# Altium schematic sheet Velotour_2022_V1.0.SchDoc: Mailbox Game
size A3; Subtitle: Velotour 2022; Organization: Crelin; Address1: Karl-Neuhaus-Strasse 6, 2502 Biel; Address3: florian.b-h@bluewin.ch; Address4: Tel. (+41) 32-323 56 25 / (+41) 79-502 92 10; DocumentNumber: Velotour 2022; Revision: V1.0; SheetNumber: 1; SheetTotal: 1; CheckedBy: Florian Baumgartner; Author: Florian Baumgartner; DrawnBy: Florian Baumgartner; Engineer: Florian Baumgartner
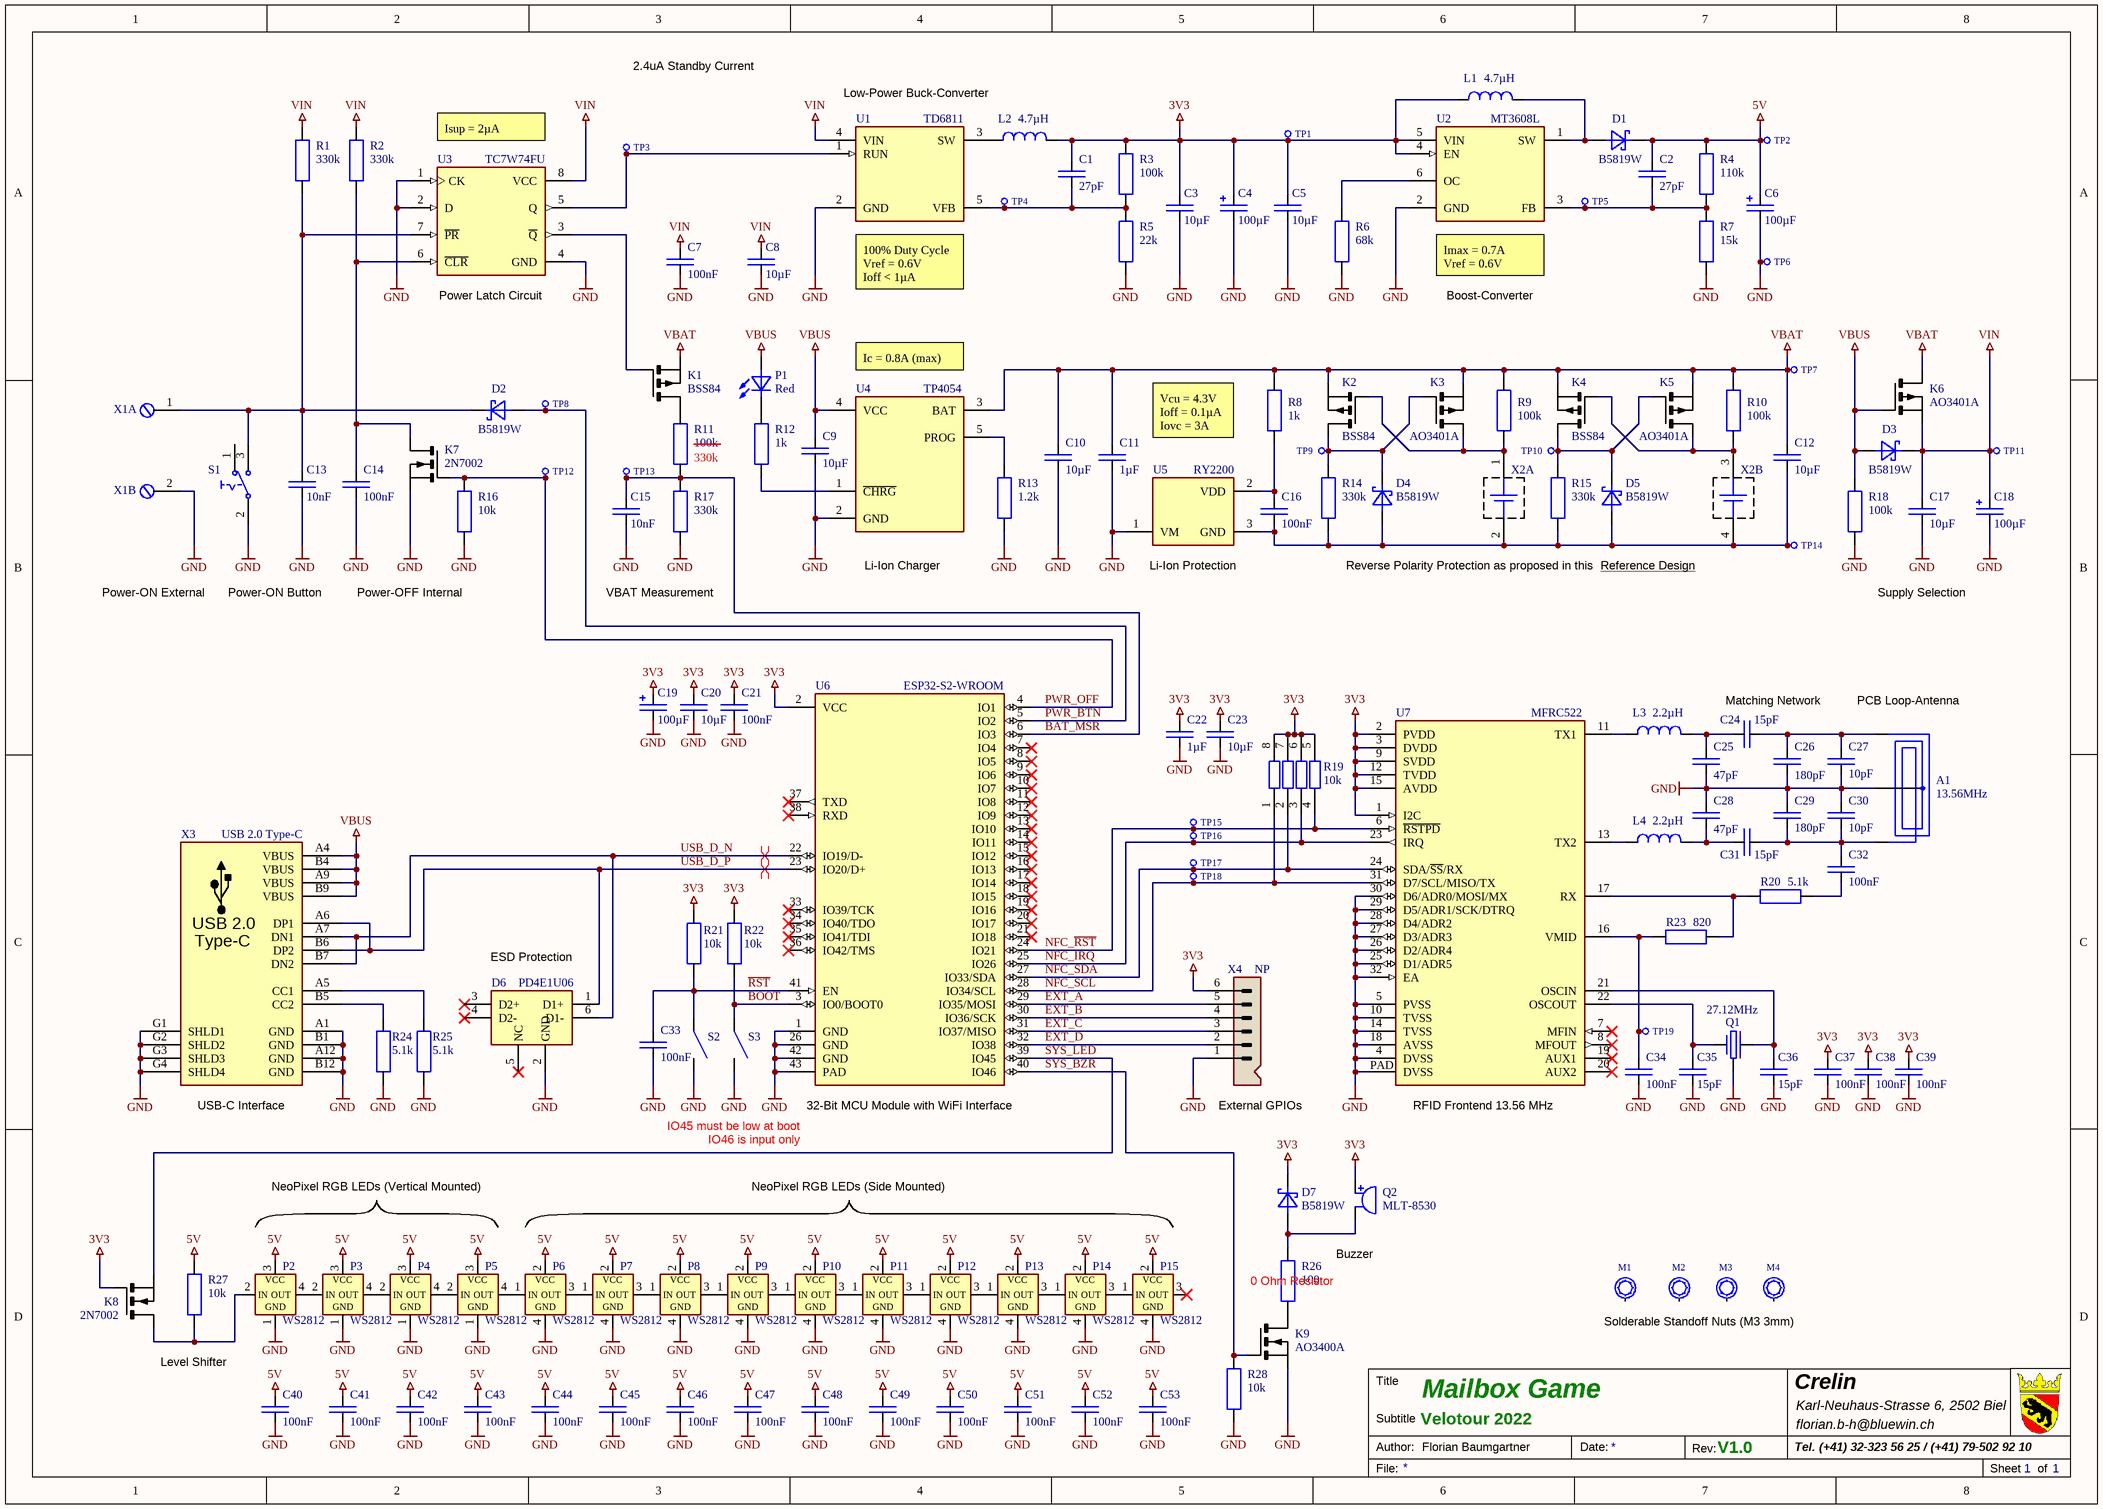
[diagram p0: Velotour_2022_V1.0.SchDoc]

## Parts
A1  13.56MHz  [SMD Loop-Antenna 13.56MHz]
C1  27pF  [SMD Keramikkondensator 0603]
C2  27pF  [SMD Keramikkondensator 0603]
C3  10µF  [SMD Keramikkondensator 1206]
C4  100µF  [SMD Tantalkondensator 1210 +]
C5  10µF  [SMD Keramikkondensator 1206]
C6  100µF  [SMD Tantalkondensator 1210 +]
C7  100nF  [SMD Keramikkondensator 0603]
C8  10µF  [SMD Keramikkondensator 1206]
C9  10µF  [SMD Keramikkondensator 1206]
C10  10µF  [SMD Keramikkondensator 1206]
C11  1µF  [SMD Keramikkondensator 0603]
C12  10µF  [SMD Keramikkondensator 1206]
C13  10nF  [SMD Keramikkondensator 0603]
C14  100nF  [SMD Keramikkondensator 0603]
C15  10nF  [SMD Keramikkondensator 0603]
C16  100nF  [SMD Keramikkondensator 0603]
C17  10µF  [SMD Keramikkondensator 1206]
C18  100µF  [SMD Tantalkondensator 1210 +]
C19  100µF  [SMD Tantalkondensator 1210 +]
C20  10µF  [SMD Keramikkondensator 1206]
C21  100nF  [SMD Keramikkondensator 0603]
C22  1µF  [SMD Keramikkondensator 0603]
C23  10µF  [SMD Keramikkondensator 1206]
C24  15pF  [SMD Keramikkondensator 0603]
C25  47pF  [SMD Keramikkondensator 0603]
C26  180pF  [SMD Keramikkondensator 0603]
C27  10pF  [SMD Keramikkondensator 0603]
C28  47pF  [SMD Keramikkondensator 0603]
C29  180pF  [SMD Keramikkondensator 0603]
C30  10pF  [SMD Keramikkondensator 0603]
C31  15pF  [SMD Keramikkondensator 0603]
C32  100nF  [SMD Keramikkondensator 0603]
C33  100nF  [SMD Keramikkondensator 0603]
C34  100nF  [SMD Keramikkondensator 0603]
C35  15pF  [SMD Keramikkondensator 0603]
C36  15pF  [SMD Keramikkondensator 0603]
C37  100nF  [SMD Keramikkondensator 0603]
C38  100nF  [SMD Keramikkondensator 0603]
C39  100nF  [SMD Keramikkondensator 0603]
C40  100nF  [SMD Keramikkondensator 0603]
C41  100nF  [SMD Keramikkondensator 0603]
C42  100nF  [SMD Keramikkondensator 0603]
C43  100nF  [SMD Keramikkondensator 0603]
C44  100nF  [SMD Keramikkondensator 0603]
C45  100nF  [SMD Keramikkondensator 0603]
C46  100nF  [SMD Keramikkondensator 0603]
C47  100nF  [SMD Keramikkondensator 0603]
C48  100nF  [SMD Keramikkondensator 0603]
C49  100nF  [SMD Keramikkondensator 0603]
C50  100nF  [SMD Keramikkondensator 0603]
C51  100nF  [SMD Keramikkondensator 0603]
C52  100nF  [SMD Keramikkondensator 0603]
C53  100nF  [SMD Keramikkondensator 0603]
D1  B5819W  [SMD Diode SOD-123]
D2  B5819W  [SMD Diode SOD-123]
D3  B5819W  [SMD Diode SOD-123]
D4  B5819W  [SMD Diode SOD-123]
D5  B5819W  [SMD Diode SOD-123]
D6  PD4E1U06  [SMD IC SOT-363 (SC-70-6)]
D7  B5819W  [SMD Diode SOD-123]
K1  BSS84  [SMD MOSFET SOT-23]
K2  BSS84  [SMD MOSFET SOT-23]
K3  AO3401A  [SMD MOSFET SOT-23]
K4  BSS84  [SMD MOSFET SOT-23]
K5  AO3401A  [SMD MOSFET SOT-23]
K6  AO3401A  [SMD MOSFET SOT-23]
K7  2N7002  [SMD MOSFET SOT-23]
K8  2N7002  [SMD MOSFET SOT-23]
K9  AO3400A  [SMD MOSFET SOT-23]
L1  4.7µH  [SMD Inductor 3.2x2.5x1.7]
L2  4.7µH  [SMD Inductor 3.2x2.5x1.7]
L3  2.2µH  [SMD Inductor 0805]
L4  2.2µH  [SMD Inductor 0805]
M1  SMTSO-M3-3ET  [SMD Solder-Nut (M3 3mm)]  (value not drawn)
M2  SMTSO-M3-3ET  [SMD Solder-Nut (M3 3mm)]  (value not drawn)
M3  SMTSO-M3-3ET  [SMD Solder-Nut (M3 3mm)]  (value not drawn)
M4  SMTSO-M3-3ET  [SMD Solder-Nut (M3 3mm)]  (value not drawn)
P1  Red  [SMD LED 0603]
P2  WS2812  [SMD LED WS2812B-3528]
P3  WS2812  [SMD LED WS2812B-3528]
P4  WS2812  [SMD LED WS2812B-3528]
P5  WS2812  [SMD LED WS2812B-3528]
P6  WS2812  [SMD LED WS2812B-4020]
P7  WS2812  [SMD LED WS2812B-4020]
P8  WS2812  [SMD LED WS2812B-4020]
P9  WS2812  [SMD LED WS2812B-4020]
P10  WS2812  [SMD LED WS2812B-4020]
P11  WS2812  [SMD LED WS2812B-4020]
P12  WS2812  [SMD LED WS2812B-4020]
P13  WS2812  [SMD LED WS2812B-4020]
P14  WS2812  [SMD LED WS2812B-4020]
P15  WS2812  [SMD LED WS2812B-4020]
Q1  27.12MHz  [SMD Crystal 3.2X2.5X0.8]
Q2  MLT-8530  [SMD Buzzer (MLT-8530)]
R1  330k  [SMD Widerstand 0603]
R2  330k  [SMD Widerstand 0603]
R3  100k  [SMD Widerstand 0603]
R4  110k  [SMD Widerstand 0603]
R5  22k  [SMD Widerstand 0603]
R6  68k  [SMD Widerstand 0603]
R7  15k  [SMD Widerstand 0603]
R8  1k  [SMD Widerstand 0603]
R9  100k  [SMD Widerstand 0603]
R10  100k  [SMD Widerstand 0603]
R11  100k  [SMD Widerstand 0603]
R12  1k  [SMD Widerstand 0603]
R13  1.2k  [SMD Widerstand 0603]
R14  330k  [SMD Widerstand 0603]
R15  330k  [SMD Widerstand 0603]
R16  10k  [SMD Widerstand 0603]
R17  330k  [SMD Widerstand 0603]
R18  100k  [SMD Widerstand 0603]
R19  10k  [SMD Widerstand Array 4-Fach 0603]
R20  5.1k  [SMD Widerstand 0603]
R21  10k  [SMD Widerstand 0603]
R22  10k  [SMD Widerstand 0603]
R23  820  [SMD Widerstand 0603]
R24  5.1k  [SMD Widerstand 0603]
R25  5.1k  [SMD Widerstand 0603]
R26  100  [SMD Widerstand 0603]
R27  10k  [SMD Widerstand 0603]
R28  10k  [SMD Widerstand 0603]
S1  SS075Q102F035V2A  [THT Micro Switch (SS075Q102F035V2A)]  (value not drawn)
S2  SMD-Button  [SMD Button 5.2x5.2]  (value not drawn)
S3  SMD-Button  [SMD Button 5.2x5.2]  (value not drawn)
TP1  X-TP  [SMD Testpunkt Ø1mm]  (value not drawn)  (no BOM)
TP2  X-TP  [SMD Testpunkt Ø1mm]  (value not drawn)  (no BOM)
TP3  X-TP  [SMD Testpunkt Ø1mm]  (value not drawn)  (no BOM)
TP4  X-TP  [SMD Testpunkt Ø1mm]  (value not drawn)  (no BOM)
TP5  X-TP  [SMD Testpunkt Ø1mm]  (value not drawn)  (no BOM)
TP6  X-TP  [SMD Testpunkt Ø1mm]  (value not drawn)  (no BOM)
TP7  X-TP  [SMD Testpunkt Ø1mm]  (value not drawn)  (no BOM)
TP8  X-TP  [SMD Testpunkt Ø1mm]  (value not drawn)  (no BOM)
TP9  X-TP  [SMD Testpunkt Ø1mm]  (value not drawn)  (no BOM)
TP10  X-TP  [SMD Testpunkt Ø1mm]  (value not drawn)  (no BOM)
TP11  X-TP  [SMD Testpunkt Ø1mm]  (value not drawn)  (no BOM)
TP12  X-TP  [SMD Testpunkt Ø1mm]  (value not drawn)  (no BOM)
TP13  X-TP  [SMD Testpunkt Ø1mm]  (value not drawn)  (no BOM)
TP14  X-TP  [SMD Testpunkt Ø1mm]  (value not drawn)  (no BOM)
TP15  X-TP  [SMD Testpunkt Ø1mm]  (value not drawn)  (no BOM)
TP16  X-TP  [SMD Testpunkt Ø1mm]  (value not drawn)  (no BOM)
TP17  X-TP  [SMD Testpunkt Ø1mm]  (value not drawn)  (no BOM)
TP18  X-TP  [SMD Testpunkt Ø1mm]  (value not drawn)  (no BOM)
TP19  X-TP  [SMD Testpunkt Ø1mm]  (value not drawn)  (no BOM)
U1  TD6811  [SMD IC SOT-23-5]
U2  MT3608L  [SMD IC SOT-23-6]
U3  TC7W74FU  [SMD IC TSSOP-8]
U4  TP4054  [SMD IC SOT-23-5]
U5  RY2200  [SMD IC SOT-23-3]
U6  ESP32-S2-WROOM  [SMD ESP32-S2-WROOM]
U7  MFRC522  [SMD IC QFN-32]
X1  X-Klemme (2-Pol)  [THT Schraubklemme 2-Pol (WJ500V-5.08-2P)]  (value not drawn)  (parts A,B of 2)
X2  18650 Dual Battery Holder  [SMD Battery-Holder (1048P)]  (value not drawn)  (parts A,B of 2)
X3  USB 2.0 Type-C  [THT USB-C Socket (KH-TYPE-C-L10-14P)]
X4  NP  [THT Pin-Header 1x6 (NP)]

## Nets
3V3: C1.1 C3.2 C4.P(+) C5.2 C19.P(+) C20.2 C21.2 C22.2 C23.2 C37.2 C38.2 C39.2 D7.K K8.G L1.1 L2.2 Q2.1(P) R3.2 R19.5 R19.6 R19.7 R19.8 R21.2 R22.2 TP1.1 U2.4(EN) U2.5(VIN) U6.2(VCC) U7.1(I2C) U7.2(PVDD) U7.3(DVDD) U7.9(SVDD) U7.12(TVDD) U7.15(AVDD) X4.6
5V: C2.1 C6.P(+) C40.2 C41.2 C42.2 C43.2 C44.2 C45.2 C46.2 C47.2 C48.2 C49.2 C50.2 C51.2 C52.2 C53.2 D1.K P2.3(VCC) P3.3(VCC) P4.3(VCC) P5.3(VCC) P6.2(VCC) P7.2(VCC) P8.2(VCC) P9.2(VCC) P10.2(VCC) P11.2(VCC) P12.2(VCC) P13.2(VCC) P14.2(VCC) P15.2(VCC) R4.2 R27.2 TP2.1
GND: A1.3(M) C3.1 C4.M(-) C5.1 C6.M(-) C7.1 C8.1 C9.1 C10.1 C11.1 C13.1 C14.1 C15.1 C17.1 C18.M(-) C19.M(-) C20.1 C21.1 C22.1 C23.1 C25.2 C26.2 C27.2 C28.1 C29.1 C30.1 C33.1 C34.1 C35.2 C36.2 C37.1 C38.1 C39.1 C40.1 C41.1 C42.1 C43.1 C44.1 C45.1 C46.1 C47.1 C48.1 C49.1 C50.1 C51.1 C52.1 C53.1 D6.2(GND) K7.S K9.S P2.1(GND) P3.1(GND) P4.1(GND) P5.1(GND) P6.4(GND) P7.4(GND) P8.4(GND) P9.4(GND) P10.4(GND) P11.4(GND) P12.4(GND) P13.4(GND) P14.4(GND) P15.4(GND) Q1.3 R5.1 R6.2 R7.1 R13.1 R16.1 R17.1 R18.1 R24.2 R25.2 R28.1 S1.2(COMMON1) S2.2 S3.2 TP6.1 U1.2(GND) U2.2(GND) U3.1(CK) U3.2(D) U3.4(GND) U4.2(GND) U5.1(VM) U6.1(GND) U6.26(GND) U6.42(GND) U6.43(PAD) U7.4(DVSS) U7.5(PVSS) U7.10(TVSS) U7.14(TVSS) U7.18(AVSS) U7.25(D1/ADR5) U7.26(D2/ADR4) U7.27(D3/ADR3) U7.28(D4/ADR2) U7.29(D5/ADR1/SCK/DTRQ) U7.30(D6/ADR0/MOSI/MX) U7.32(EA) U7.PAD(DVSS) X1.2 X3.A1(GND) X3.A12(GND) X3.B1(GND) X3.B12(GND) X3.G1(SHLD1) X3.G2(SHLD2) X3.G3(SHLD3) X3.G4(SHLD4) X4.1
VBAT: C10.2 C11.2 C12.2 K1.S K2.S K3.S K4.S K5.S K6.D R8.2 R9.2 R10.2 TP7.1 U4.3(BAT)
VBUS: C9.2 D3.A K6.G P1.A R18.2 U4.4(VCC) X3.A4(VBUS) X3.A9(VBUS) X3.B4(VBUS) X3.B9(VBUS)
VIN: C7.2 C8.2 C17.2 C18.P(+) D3.K K6.S R1.2 R2.2 TP11.1 U1.4(VIN) U3.8(VCC)
BAT_MSR: C15.2 R11.1 R17.2 TP13.1 U6.6(IO3)
BOOT: R22.1 S3.1 U6.3(IO0/BOOT0)
EXT_A: U6.29(IO35/MOSI) X4.5
EXT_B: U6.30(IO36/SCK) X4.4
EXT_C: U6.31(IO37/MISO) X4.3
EXT_D: U6.32(IO38) X4.2
NFC_~{IRQ}: R19.3 TP16.1 U6.25(IO26) U7.23(IRQ)
NFC_~{RST}: R19.4 TP15.1 U6.24(IO21) U7.6(~{RSTPD})
NFC_SCL: R19.1 TP18.1 U6.28(IO34/SCL) U7.31(D7/SCL/MISO/TX)
NFC_SDA: R19.2 TP17.1 U6.27(IO33/SDA) U7.24(SDA/~{SS}/RX)
PWR_BTN: D2.A TP8.1 U6.5(IO2)
PWR_OFF: K7.G R16.2 TP12.1 U6.4(IO1)
~{RST}: C33.2 R21.1 S2.1 U6.41(EN)
SYS_BZR: K9.G R28.2 U6.40(IO46)
SYS_LED: K8.S U6.39(IO45)
USB_D_N: D6.6(D1-) U6.22(IO19/D-) X3.A7(DN1) X3.B7(DN2)
USB_D_P: D6.1(D1+) U6.23(IO20/D+) X3.A6(DP1) X3.B6(DP2)
NetA1_1: A1.1(A) C24.2 C26.1 C27.1
NetA1_2: A1.2(B) C29.2 C30.2 C31.2 C32.1
NetC1_2: C1.2 R3.1 R5.2 TP4.1 U1.5(VFB)
NetC2_2: C2.2 R4.1 R7.2 TP5.1 U2.3(FB)
NetC12_1: C12.1 C16.1 D4.A D5.A R14.1 R15.1 TP14.1 U5.3(GND) X2.2(B1N) X2.4(B2N)
NetC13_2: C13.2 D2.K R1.1 S1.3(NO1) U3.7(~{PR}) X1.1
NetC14_2: C14.2 K7.D R2.1 U3.6(~{CLR})
NetC16_2: C16.2 R8.1 U5.2(VDD)
NetC24_1: C24.1 C25.1 L3.2
NetC28_2: C28.2 C31.1 L4.2
NetC32_2: C32.2 R20.2
NetC34_2: C34.2 R23.2 TP19.1 U7.16(VMID)
NetC35_1: C35.1 Q1.1 U7.22(OSCOUT)
NetC36_1: C36.1 Q1.2 U7.21(OSCIN)
NetD1_A: D1.A L1.2 U2.1(SW)
NetD4_K: D4.K K2.D K3.G R14.2 TP9.1
NetD5_K: D5.K K4.D K5.G R15.2 TP10.1
NetD7_A: D7.A Q2.2(M) R26.1
NetK1_D: K1.D R11.2
NetK1_G: K1.G U3.3(~{Q})
NetK2_G: K2.G K3.D R9.1 X2.1(B1P)
NetK4_G: K4.G K5.D R10.1 X2.3(B2P)
NetK8_D: K8.D P2.2(IN) R27.1
NetK9_D: K9.D R26.2
NetL2_1: L2.1 U1.3(SW)
NetL3_1: L3.1 U7.11(TX1)
NetL4_1: L4.1 U7.13(TX2)
NetP1_K: P1.K R12.1
NetP2_4: P2.4(OUT) P3.2(IN)
NetP3_4: P3.4(OUT) P4.2(IN)
NetP4_4: P4.4(OUT) P5.2(IN)
NetP5_4: P5.4(OUT) P6.1(IN)
NetP6_3: P6.3(OUT) P7.1(IN)
NetP7_3: P7.3(OUT) P8.1(IN)
NetP8_3: P8.3(OUT) P9.1(IN)
NetP9_3: P9.3(OUT) P10.1(IN)
NetP10_3: P10.3(OUT) P11.1(IN)
NetP11_3: P11.3(OUT) P12.1(IN)
NetP12_3: P12.3(OUT) P13.1(IN)
NetP13_3: P13.3(OUT) P14.1(IN)
NetP14_3: P14.3(OUT) P15.1(IN)
NetR6_1: R6.1 U2.6(OC)
NetR12_2: R12.2 U4.1(~{CHRG})
NetR13_2: R13.2 U4.5(PROG)
NetR20_1: R20.1 R23.1 U7.17(RX)
NetR24_1: R24.1 X3.B5(CC2)
NetR25_1: R25.1 X3.A5(CC1)
NetTP3_1: TP3.1 U1.1(RUN) U3.5(Q)

Not connected (* = marked no-connect by the designer): D6 3(D2+)* 4(D2-)* 5(NC)*; M1 1; M2 1; M3 1; M4 1; P15 3(OUT)*; S1 1(NC1); U6 7(IO4)* 8(IO5)* 9(IO6)* 10(IO7)* 11(IO8)* 12(IO9)* 13(IO10)* 14(IO11)* 15(IO12)* 16(IO13)* 17(IO14)* 18(IO15)* 19(IO16)* 20(IO17)* 21(IO18)* 33(IO39/TCK)* 34(IO40/TDO)* 35(IO41/TDI)* 36(IO42/TMS)* 37(TXD)* 38(RXD)*; U7 7(MFIN)* 8(MFOUT)* 19(AUX1)* 20(AUX2)*

## Layout directives
differential pair: USB_D_N, USB_D_P

## Notes on the sheet
- 2.4uA Standby Current
- Low-Power Buck-Converter
- (near U3) Isup = 2µA
- (near U3) Power Latch Circuit
- (near U1) 100% Duty Cycle
  Vref = 0.6V
  Ioff < 1µA
- (near U2) Imax = 0.7A
  Vref = 0.6V
- Boost-Converter
- (near U4) Ic = 0.8A (max)
- (near R11) 330k
- Vcu = 4.3V
  Ioff = 0.1µA
  Iovc = 3A
- Power-ON External
- Power-ON Button
- Power-OFF Internal
- VBAT Measurement
- (near U4) Li-Ion Charger
- (near U5) Li-Ion Protection
- Reverse Polarity Protection as proposed in this
- Reference Design <https://www.edn.com/reverse-voltage-protection-for-battery-chargers/>
- Supply Selection
- (near C24) Matching Network
- (near A1) PCB Loop-Antenna
- (near D6) ESD Protection
- (near X3) USB-C Interface
- (near U6) IO45 must be low at boot
- (near U6) 32-Bit MCU Module with WiFi Interface
- (near X4) External GPIOs
- (near U7) RFID Frontend 13.56 MHz
- NeoPixel RGB LEDs (Vertical Mounted)
- IO46 is input only
- NeoPixel RGB LEDs (Side Mounted)
- Buzzer
- 0 Ohm Resistor
- Solderable Standoff Nuts (M3 3mm)
- Level Shifter
- Title
- Crelin
- Author:
- Subtitle
- Date:
- Rev:
- File:
- Sheet
- of
- (in symbol X-USB-Buchse_Vertical) USB 2.0

## Library data of the parts
A1 = A-Loop-Antenna: PCB Loop-Antenna; Component Description: PCB Loop-Antenna; Component Value: 13.56MHz; Unit Price: 0.00
C1 C2 = C-CAPACITOR: CAP-MK; Component Description: Multilayer Ceramic Capacitors; Component Value: 27pF 50V; Digikey: 399-C0603C270J5GAC7867CT-ND; Farnell: 1414627; Mouser: 80-C0603C270J5G; JLC-Parts: C107045; Unit Price: 0.01
C3 C5 C8 = C-CAPACITOR: CAP-MK; Component Description: Multilayer Ceramic Capacitors; Component Value: 10µF 50V; Digikey: 445-7886-1-ND; Farnell: 2211092; Mouser: 810-CGA5L3X5R1H106K; JLC-Parts: C13585; Unit Price: 0.27
C4 C6 C18 C19 = C-ELCAP: CAP-Elko; Component Description: Tantalum Capacitor; Component Value: 100µF 6.3V; Digikey: 478-1677-1-ND; Farnell: 1135048; Mouser: 581-TAJB107K006R; JLC-Parts: C16133; Unit Price: 0.08
C7 C14 C16 C21 C32-C34 C37-C53 = E6 - 100nF: SMD Ceramic Capacitor E6; Component Value: 100nF 50V; Component Description: Multilayer Ceramic Capacitors MLCC; ComponentLink1Description: Datasheet; ComponentLink1URL: https://datasheet.lcsc.com/lcsc/1809301912_YAGEO-CC0603KRX7R9BB104_C14663.pdf; Digikey: 445-6899-1-ND; Farnell: 2210822; JLC-Parts: C14663; Mouser: 810-CGA2B3X7R1H104K; Unit Price: 0.01
C9 C10 C12 C17 C20 C23 = E6 - 10uF: SMD Ceramic Capacitor E6; Component Value: 10µF 50V; Component Description: Multilayer Ceramic Capacitors MLCC; ComponentLink1Description: Datasheet; ComponentLink1URL: https://datasheet.lcsc.com/lcsc/1810191219_Samsung-Electro-Mechanics-CL10A106KP8NNNC_C19702.pdf; Digikey: 587-3258-1-ND; Farnell: 2113070; JLC-Parts: C13585; Mouser: 963-LMK107BBJ106MALT; Unit Price: 0.01
C11 C22 = C-CAPACITOR: CAP-MK; Component Description: Multilayer Ceramic Capacitors; Component Value: 1µF 50V; Digikey: 1276-1860-1-ND; Farnell: 3013383; Mouser: 187-CL10A105KB8NNNC; JLC-Parts: C15849; Unit Price: 0.01
C13 C15 = C-CAPACITOR: CAP-MK; Component Description: Multilayer Ceramic Capacitors; Component Value: 10nF 50V; Digikey: 445-5662-1-ND; Farnell: 2346966; Mouser: 77-VJ0603V103ZXAPBC; JLC-Parts: C57112; Unit Price: 0.01
C24 C31 C35 C36 = C-CAPACITOR: CAP-MK; Component Description: Multilayer Ceramic Capacitors; Component Value: 15pF 50V; Digikey: 399-C0603C150J5GAC7867CT-ND; Farnell: 1414614; Mouser: 80-C0603C150J5G; JLC-Parts: C1644; Unit Price: 0.01
C25 C28 = C-CAPACITOR: CAP-MK; Component Description: Multilayer Ceramic Capacitors; Component Value: 47pF 50V; Digikey: 399-C0603C470J5GAC7867CT-ND; Farnell: 1414639; Mouser: 80-C0603C470J5G; JLC-Parts: C1671; Unit Price: 0.01
C26 C29 = C-CAPACITOR: CAP-MK; Component Description: Multilayer Ceramic Capacitors; Component Value: 180pF 50V; Digikey: 399-C0603C181J5GAC7867CT-ND; Farnell: 1414621; Mouser: 80-C0603C181J5G; JLC-Parts: C85299; Unit Price: 0.01
C27 C30 = C-CAPACITOR: CAP-MK; Component Description: Multilayer Ceramic Capacitors; Component Value: 10pF 50V; Digikey: 399-C0603C100J5GAC7867CT-ND; Farnell: 1414601; Mouser: 80-C0603C100J5G; JLC-Parts: C1634; Unit Price: 0.01
D1-D5 D7 = R-DIODE:SCHKY: S-DIODE; Component Description: Low Voltage Schottky-Diode; Mouser: 833-B5819W-TP; Farnell: 2306459; Digikey: B5819W-TPMSCT-ND; JLC-Parts: C8598; Component Value: B5819W; Unit Price: 0.03
D6 = PD4E1U06DCKR: Unidirectional 3A (8/20us) 15V (Typ) 6.5V 5.5V (Max) SOT-363 ESD Protection Devices ROHS; Component Description: ESD Suppressor; ComponentLink1Description: Datasheet; ComponentLink1URL: https://datasheet.lcsc.com/lcsc/1810172210_Texas-Instruments-TPD4E1U06DCKR_C194628.pdf; Component Value: PD4E1U06; Digikey: 296-39347-1-ND; Farnell: 3116516; JLC-Parts: C194628; Mouser: 595-TPD4E1U06DCKR; Unit Price: 0.12
K1 K2 K4 = K-FET:PIGE: MOSFET P-Channel; Component Value: LBSS84LT1G; Digikey: 1801-BSS84CT-ND; Farnell: 1713836; Mouser: 771-BSS84-T/R; Component Description: MOSFET P-Channel; ComponentLink1Description: Datasheet; ComponentLink1URL: https://datasheet.lcsc.com/lcsc/1811031711_LRC-LBSS84LT1G_C8492.pdf; JLC-Parts: C8492; Unit Price: 0.03
K3 K5 K6 = K-FET:PIGE: MOSFET P-Channel; Digikey: 785-1001-1-ND; Component Description: MOSFET P-Channel; ComponentLink1Description: Datasheet; ComponentLink1URL: https://datasheet.lcsc.com/lcsc/1810171817_Alpha---Omega-Semicon-AO3401A_C15127.pdf; Component Value: AO3401A; JLC-Parts: C15127; Unit Price: 0.14
K7-K9 = K-FET:NIGE: MOSFET N-Channel; ComponentLink1Description: Datasheet; Component Description: MOSFET N-Channel
  K7 K8: Digikey: 2N7002NCT-ND; Farnell: 1713823; Mouser: 512-2N7002; ComponentLink1URL: https://datasheet.lcsc.com/lcsc/1810151612_Jiangsu-Changjing-Electronics-Technology-Co---Ltd--2N7002_C8545.pdf; Component Value: 2N7002; JLC-Parts: C8545; Unit Price: 0.02
  K9: Digikey: 785-1000-1-ND; ComponentLink1URL: http://www.aosmd.com/pdfs/datasheet/AO3400A.pdf; Component Value: AO3400A; JLC-Parts: C20917; Unit Price: 0.20
L1 L2 = L-COIL: Shielded Power Inductor; Component Description: Molded Power Inductor; Component Value: LQH32PN4R7NN0L (4.7µH, 1.0A); Farnell: 2470296; Mouser: 81-LQH32PN4R7NN0L; Digikey: 490-5338-1-ND; JLC-Parts: C98021; Unit Price: 0.12
L3 L4 = L-COIL: Multilayer Chip Inductor; Farnell: 2871431; Mouser: 81-DFE201210U-2R2MP2; Digikey: 490-16592-1-ND; JLC-Parts: C1043; Component Description: Multilayer Chip Inductor; Component Value: 2.2µH; Unit Price: 0.01
M1-M4 = M-Spacer_M3_3mm: Solderable Standoff Nut; Component Value: M3 3mm; Mouser: 153-SMTSO-M3-3ET; Component Description: Solderable Standoff Nut; Unit Price: 0.05; JLC-Parts: C2915308; ComponentLink1Description: Datasheet; ComponentLink1URL: https://datasheet.lcsc.com/lcsc/2112061830_Sinhoo-SMTSO3030CTJ_C2915308.pdf
P1 = P-LED: LED (als Lampe E / alt H); Component Description: Low Power LED; Component Value: Red (5mA, 2.0V); Digikey: 350-2029-1-ND; Farnell: 1465988; Mouser: 645-598-8010-107F; ComponentLink1Description: Datasheet; ComponentLink1URL: https://datasheet.lcsc.com/szlcsc/Hubei-KENTO-Elec-KT-0603R_C2286.pdf; JLC-Parts: C2286; Unit Price: 0.34
P2-P5 = P-WS2812B-3528: Smart RGB-LED; aliExpress: 1005003999865721; Component Value: XL-3528RGBW-WS2812B; JLC-Parts: C2890364; ComponentLink1Description: Datasheet; ComponentLink1URL: https://datasheet.lcsc.com/lcsc/2108271830_XINGLIGHT-XL-3528RGBW-WS2812B_C2890364.pdf; Component Description: Smart RGB-LED; Unit Price: 0.06
P6-P15 = P-WS2812B-4020: Smart RGB-LED; aliExpress: 33031289356; JLC-Parts: C965557; ComponentLink1Description: Datasheet; ComponentLink1URL: https://datasheet.lcsc.com/lcsc/2012110135_Worldsemi-WS2812B-4020_C965557.pdf; Component Description: Smart RGB-LED; Component Value: WS2812B-4020; Unit Price: 0.12
Q1 = B-QUARZ-CAP: Component Description: Crystal; Digikey: 50-ECS-271.2-18-33-JGN-TR3CT-ND; Farnell: 3649643; Mouser: 520-271.2-1833JGNTR3; ComponentLink1Description: Datasheet; ComponentLink1URL: https://datasheet.lcsc.com/lcsc/2103291134_Yangxing-Tech-X32252712MMB4SI_C29975.pdf; Component Value: 27.12Mhz; JLC-Parts: C29975; Unit Price: 0.08
Q2 = Q-Buzzer: Electromagnetic Buzzer; Digikey: 458-1052-ND; Farnell: 1801084; Mouser: 539-AST200Q; JLC-Parts: C94599; ComponentLink1Description: Datasheet; ComponentLink1URL: https://datasheet.lcsc.com/lcsc/1811151451_Jiangsu-Huaneng-Elec-MLT-8530_C94599.pdf; Component Description: Electromagnetic Buzzer; Component Value: MLT-8530; Unit Price: 0.27
R1 R2 R14 R15 R17 = R-RESISTOR: RES (E=Heizwiderstand B=Messwandler); Component Description: Thick Film Chip Resistor; Component Value: 330k (75V, 100mW, 1%); Digikey: P330KHCT-ND; Farnell: 2303270; Mouser: 667-ERJ-3EKF3303V; JLC-Parts: C23137; Unit Price: 0.01
R3 R9-R11 R18 = R-RESISTOR: RES (E=Heizwiderstand B=Messwandler); Component Description: Thick Film Chip Resistor; Component Value: 100k (75V, 100mW, 1%); Digikey: P100KHCT-ND; Farnell: 2303232; Mouser: 667-ERJ-3EKF1003V; JLC-Parts: C25803; Unit Price: 0.01
R4 = R-RESISTOR: RES (E=Heizwiderstand B=Messwandler); Component Description: Dickschicht Chipwiderstand; Component Value: 110k (75V, 100mW, 1%); Digikey: P110KHCT-ND; Farnell: 2059495; Mouser: 667-ERJ-3EKF1103V; JLC-Parts: C25805; Unit Price: 0.01
R5 = R-RESISTOR: RES (E=Heizwiderstand B=Messwandler); Component Description: Thick Film Chip Resistor; Component Value: 22k (75V, 100mW, 1%); Digikey: P22.0KHCT-ND; Farnell: 2303201; Mouser: 667-ERJ-3EKF2202V; JLC-Parts: C31850; Unit Price: 0.01
R6 = R-RESISTOR: RES (E=Heizwiderstand B=Messwandler); Component Description: Dickschicht Chipwiderstand; Component Value: 68k (75V, 100mW, 1%); Digikey: 311-68.0KHRTR-ND; Farnell: 9238700; Mouser: 603-RC0603FR-0768KL; JLC-Parts: C23231; Unit Price: 0.06
R7 = R-RESISTOR: RES (E=Heizwiderstand B=Messwandler); Component Description: Dickschicht Chipwiderstand; Component Value: 15k (75V, 100mW, 1%); Digikey: P15.0KHCT-ND; Farnell: 2211092; Mouser: 667-ERJ-3EKF1502V; JLC-Parts: C22809; Unit Price: 0.01
R8 R12 = R-RESISTOR: RES (E=Heizwiderstand B=Messwandler); Component Description: Dickschicht Chipwiderstand; Component Value: 1k (75V, 100mW, 1%); Digikey: P1.00KHCT-ND; Farnell: 2303145; Mouser: 667-ERJ-3EKF1001V; JLC-Parts: C21190; Unit Price: 0.01
R13 = R-RESISTOR: RES (E=Heizwiderstand B=Messwandler); Component Description: Dickschicht Chipwiderstand; Component Value: 1.2k (75V, 100mW, 1%); Digikey: P1.20KHCT-ND; Farnell: 2303150; Mouser: 667-ERJ-3EKF1201V; JLC-Parts: C22765; Unit Price: 0.01
R16 R21 R22 R27 R28 = R-RESISTOR: RES (E=Heizwiderstand B=Messwandler); Component Description: Thick Film Chip Resistor; Component Value: 10k (75V, 100mW, 1%); Digikey: P10.0KHCT-ND; Farnell: 2303192; Mouser: 667-ERJ-3EKF1002V; JLC-Parts: C25804; Unit Price: 0.01
R19 = R-Array Single Quad E24 - 10k: Isolated Resistor Array; Component Value: 10k (4x, 50V, 62.5mW, 5%); ComponentLink1Description: Datasheet; ComponentLink1URL: https://datasheet.lcsc.com/lcsc/1810191515_UNI-ROYAL-Uniroyal-Elec-4D03WGJ0103T5E_C29718.pdf; Digikey: Y4103CT-ND; Farnell: 2060167; JLC-Parts: C29718; Mouser: 667-EXB-V8V103JV; Unit Price: 0.01; Component Description: Isolated Resistor Array
R20 R24 R25 = R-RESISTOR: RES (E=Heizwiderstand B=Messwandler); Component Description: Thick Film Chip Resistor; Component Value: 5.1k (75V, 100mW, 1%); Digikey: P5.10KHCT-ND; Farnell: 2059378; Mouser: 667-ERJ-3EKF5101V; JLC-Parts: C23186; Unit Price: 0.01
R23 = R-RESISTOR: SMD-Widerstand 1/4W; Component Description: Dickschicht Chipwiderstand; Component Value: 820 (75V, 100mW, 1%); Digikey: P820HCT-ND; Farnell: 2303136; Mouser: 667-ERJ-3EKF8200V; JLC-Parts: C23253; Unit Price: 0.01
R26 = R-RESISTOR: SMD-Widerstand 1/4W; Component Description: Thick Film Chip Resistor; Component Value: 100 (75V, 100mW, 1%); Digikey: P100HCT-ND; Farnell: 2303059; Mouser: 667-ERJ-3EKF1000X; JLC-Parts: C22775; Unit Price: 0.01
S1 = S-PCM12SMTR: Micro Detector Switch; aliExpress: 32939882024; Component Value: SS075Q102F035V2A (Right Angled); Digikey: EG4929-ND; Mouser: 612-SS075Q102F035V2A; Farnell: 2844089; ComponentLink1Description: Datasheet; Component Description: Micro Detector Switch; Unit Price: 0.18
S2 S3 = Button 3mmx2.5mm: Button SPST; Component Value: TS-1187A-B-A-B; Component Description: Tactile Switch; Digikey: CKN12221-1-ND; ComponentLink1Description: Datasheet; ComponentLink1URL: https://datasheet.lcsc.com/lcsc/2002271431_XKB-Connectivity-TS-1187A-B-A-B_C318884.pdf; Farnell: 3780596; JLC-Parts: C318884; Mouser: 611-PTS526SK15SMR2L; Unit Price: 0.02
TP1-TP19 = X-TP: Testpunkt; Component Value: Ø 0.8mm; Component Description: Testpunkt; Unit Price: 0.00
U1 = U-TD6811: 1.5MHz 1.2A Synchronous Step-Down Converter; ComponentLink1Description: Datasheet; ComponentLink1URL: https://datasheet.lcsc.com/lcsc/1811061612_Techcode-Semicon-TD6811_C189486.pdf; Component Value: TD6811; JLC-Parts: C189486; Unit Price: 0.14; Component Description: 1.5MHz 1.2A Synchronous Step-Down Converter
U2 = U-MT3608L: 1.2MHz 2.5A Current Mode Step-Up Converter; ComponentLink1Description: Datasheet; ComponentLink1URL: https://datasheet.lcsc.com/lcsc/2201121530_XI-AN-Aerosemi-Tech-MT3608L_C2932326.pdf; Component Value: MT3608L; JLC-Parts: C2932326; Unit Price: 0.09; Component Description: 1.2MHz 2.5A Current Mode Step-Up Converter
U3 = U-TC7W74FU: Low-Power D-Flip-Flop with Preset & Clear; ComponentLink1Description: Datasheet; ComponentLink1URL: https://datasheet.lcsc.com/lcsc/1811081942_TOSHIBA-TC7W74FU-LF_C128631.pdf; Digikey: TC7W74FULFCT-ND; Component Value: TC7W74FU; Farnell: 3872351; JLC-Parts: C128631; Unit Price: 0.52; Component Description: Low-Power D-Flip-Flop with Preset & Clear
U4 = U-TP4054: Standalone Linear Li-Ion Battery Charger; ComponentLink1Description: Datasheet; ComponentLink1URL: http://images.100y.com.tw/pdf_file/38-TP-TP4054x.pdf; Component Value: TP4054; JLC-Parts: C32574; Unit Price: 0.14; Component Description: Standalone Linear Li-Ion Battery Charger
U5 = U-RY2200: One Cell Li-ion and Li-poly Battery Protection IC; ComponentLink1Description: Datasheet; ComponentLink1URL: https://datasheet.lcsc.com/lcsc/2108251630_RYCHIP-Semiconductor-Inc--RY2200_C2888102.pdf; Component Value: RY2200; JLC-Parts: C2888102; Unit Price: 0.05; Component Description: One Cell Li-ion and Li-poly Battery Protection IC
U6 = ESP32-S2-WROOM: WiFi 802.11b/g/n Transceiver Module 2.4GHz Antenna, I-PEX Surface Mount; Component Description: Xtensa single-core 32-bit LX7 MCU; ComponentLink1Description: Datasheet; ComponentLink1URL: https://www.espressif.com/sites/default/files/documentation/esp32-s2-wroom_esp32-s2-wroom-i_datasheet_en.pdf; Digikey: 1965-ESP32-S2-WROOMTR-ND; Component Value: ESP32-S2-WROOM; JLC-Parts: C967026; Mouser: 356-ESP32S2WRMI320UH; Unit Price: 2.54
U7 = U-MFRC522: Standard performance MIFARE and NTAG frontend; ComponentLink1Description: Datasheet; ComponentLink1URL: https://media.digikey.com/pdf/Data%20Sheets/NXP%20PDFs/MFRC522.pdf; Digikey: 568-8603-ND; Component Value: MFRC522; Farnell: 1902838; JLC-Parts: C2760772; Mouser: 771-MFRC52202HN1151; Unit Price: 0.88; Component Description: Standard performance MIFARE and NTAG frontend
X1 = X-Klemme (2-Pol): Component Description: Schraubklemme; Component Value: WJ500V-5.08-2P (2-Pol, 250V, 8A, 5.08mm); ComponentLink1Description: Datasheet; ComponentLink1URL: https://datasheet.lcsc.com/lcsc/1912251636_Ningbo-Kangnex-Elec-WJ500V-5-08-2P_C8465.pdf; JLC-Parts: C8465; Unit Price: 0.08
X2 = X-18650_Dual-Holder: Component Value: 1049P; AliExpress: 4001152338150; Digikey: 36-1049P-ND; Farnell: 2674339; Mouser: 534-1049P; Unit Price: 0.73; ComponentLink1Description: Datasheet; ComponentLink1URL: https://www.keyelco.com/userAssets/file/M65p27.pdf; Component Description: 18650 Dual Battery Holder
X3 = X-USB-Buchse_Vertical: Type-C; aliExpress: 1005003021508194; Component Description: USB Connector Type-C Vertical; Component Value: KH-TYPE-C-L10-14P; ComponentLink1Description: Datasheet; ComponentLink1URL: https://datasheet.lcsc.com/lcsc/2103161911_Shenzhen-Kinghelm-Elec-KH-TYPE-C-L10-14P_C2761226.pdf; JLC-Parts: C2761226; Unit Price: 0.27
X4 = X-Stiftleiste (6-Fach): Component Description: Pin Header